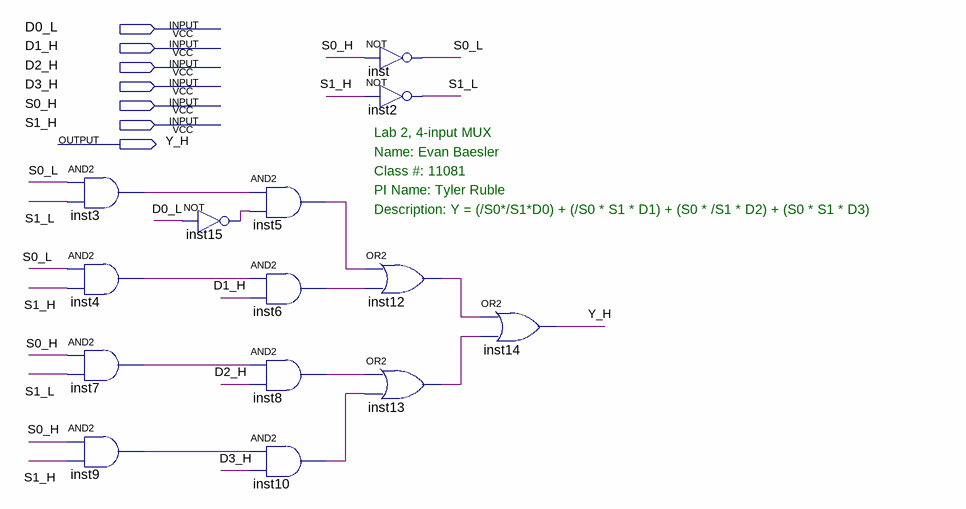
[diagram p0: schematic sheet]
// Quartus schematic lab2_4inMUX.bdf as structural Verilog: 14 symbols, 7 pins
module lab2_4inMUX (
  input  D0_L,
  input  D1_H,
  input  D2_H,
  input  D3_H,
  input  S0_H,
  input  S1_H,
  output Y_H
);

  wire inst3_out, inst4_out, inst5_out, inst6_out, inst7_out, inst8_out, inst9_out, inst10_out, inst12_out,
       inst13_out, inst15_out, S0_L, S1_L;

  and inst3 (inst3_out, S0_L, S1_L);
  and inst4 (inst4_out, S0_L, S1_H);
  and inst7 (inst7_out, S0_H, S1_L);
  and inst9 (inst9_out, S0_H, S1_H);
  not inst15 (inst15_out, D0_L);
  and inst5 (inst5_out, inst3_out, inst15_out);
  and inst6 (inst6_out, inst4_out, D1_H);
  and inst8 (inst8_out, inst7_out, D2_H);
  and inst10 (inst10_out, inst9_out, D3_H);
  not inst (S0_L, S0_H);
  not inst2 (S1_L, S1_H);
  or inst12 (inst12_out, inst5_out, inst6_out);
  or inst13 (inst13_out, inst8_out, inst10_out);
  or inst14 (Y_H, inst12_out, inst13_out);

  // Notes on the sheet:
  //   Lab 2, 4-input MUX
  //   Name: Evan Baesler
  //   Class #: 11081
  //   PI Name: Tyler Ruble
  //   Description: Y = (/S0*/S1*D0) + (/S0 * S1 * D1) + (S0 * /S1 * D2) + (S0 * S1 * D3)
endmodule
